# EAGLE design AlmosFinalMC (EAGLE 7.5.0)
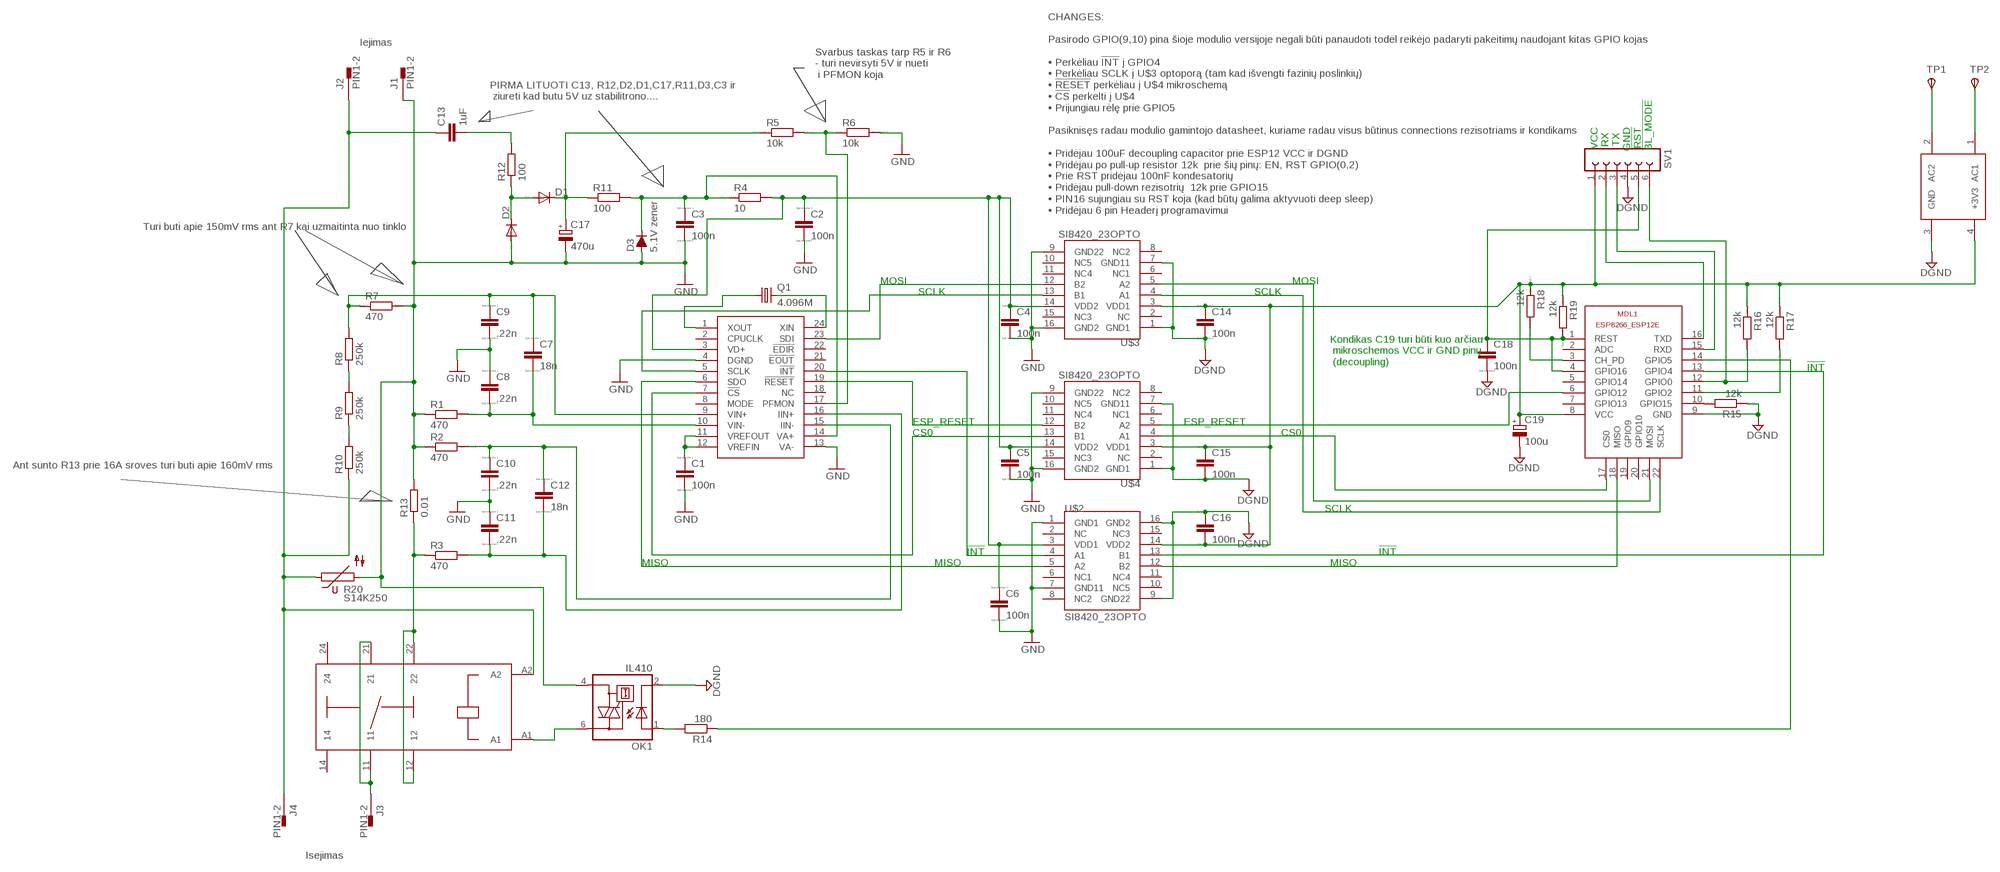
[diagram p0: schematic, sheet 1]

## Parts
C1  100n  C  [C0805]
C2  100n  C  [C0805]
C3  100n  C  [C0805]
C4  100n  C  [C0805]
C5  100n  C  [C0805]
C6  100n  C  [C0805]
C7  18n  C  [C0805]
C8  .22n  C  [C0805]
C9  .22n  C  [C0805]
C10  .22n  C  [C0805]
C11  .22n  C  [C0805]
C12  18n  C  [C0805]
C13  1uF  C-EU225-113X268  [C225-113X268]
C14  100n  C  [C0805]
C15  100n  C  [C0805]
C16  100n  C  [C0805]
C17  470u  CPOL-EUG  [PANASONIC_G]
C18  100n  C  [C0805]
C19  100u  CPOL-EUG  [PANASONIC_G]
D1  DIODE-DO-214AC  [DO-214AC]
D2  DIODE-DO-214AC  [DO-214AC]
D3  5.1V zener  D-FILL-SOD123  [SOD123]
J1  PIN1-2  [62221]
J2  PIN1-2  [62221]
J3  PIN1-2  [62221]
J4  PIN1-2  [62221]
MDL1  ESP8266-12EESP8266-ESP12E  [ESP8266-ESP12E]
OK1  IL410  [DIL06]
Q1  4.096M  CRYSTALHC49UP  [HC49UP]
R1  470  R  [R0805]
R2  470  R  [R0805]
R3  470  R  [R0805]
R4  10  R  [R0805]
R5  10k  R  [R0805]
R6  10k  R  [R0805]
R7  470  R  [R0805]
R8  250k  R-EU_0204/5  [0204/5]
R9  250k  R-EU_0204/5  [0204/5]
R10  250k  R-EU_0204/5  [0204/5]
R11  100  R-EU_0207/5V  [0207/5V]
R12  100  R-EU_0309/10  [0309/10]
R13  0.01  R-EU_RDH/15  [RDH/15]
R14  180  R-EU_R0805  [R0805]
R15  12k  R  [R0805]
R16  12k  R  [R0805]
R17  12k  R  [R0805]
R18  12k  R  [R0805]
R19  12k  R  [R0805]
R20  S14K250  [S14K250]
SV1  FE06-1  [FE06]
TP1  TPSPAD1-20Y  [P1-20Y]
TP2  TPSPAD1-20Y  [P1-20Y]
U$1  CS5460A  [SSOP24]
U$2  SI8420_23OPTO  [SI8420-SOIC8WB]
U$3  SI8420_23OPTO  [SI8420-SOIC8WB]
U$4  SI8420_23OPTO  [SI8420-SOIC8WB]
U$5  RAC02  [RAC02]
U$6  FINDER40-61  [FINDER40-61]

## Nets
DGND: C14.2 C15.2 C16.1 C18.2 C19.- MDL1.9(GND) OK1.2(C) R15.1 SV1.4 U$2.9(GND22) U$2.16(GND2) U$3.1(GND1) U$3.7(GND11) U$4.1(GND1) U$4.7(GND11) U$5.3(GND)
GND: C1.2 C2.2 C3.2 C4.2 C5.2 C6.2 C8.1 C9.2 C10.2 C11.1 C17.- D2.A D3.2(A) J1.1 OK1.4(A1) R1.1 R2.1 R6.2 R7.2 R13.2 R20.2 U$1.4(DGND) U$1.13(VA-) U$2.1(GND1) U$2.7(GND11) U$3.9(GND22) U$3.16(GND2) U$4.9(GND22) U$4.16(GND2)
N$1: C3.1 D3.1(C) R4.1 R11.2 U$1.14(VA+)
N$2: C2.1 C4.1 C5.1 C6.1 R4.2 U$1.3(VD+) U$2.3(VDD1) U$3.14(VDD2) U$4.14(VDD2)
N$3: R5.2 R6.1 U$1.17(PFMON)
N$4: C7.1 C9.1 R7.1 R8.2 U$1.9(VIN+)
N$5: U$1.23(SDI) U$3.12(B2)
N$6: C7.2 C8.2 R1.2 U$1.10(VIN-)
N$7: C17.+ D1.C R5.1 R11.1
N$8: D1.A D2.C R12.1
N$9: MDL1.14(GPIO5) R14.1
N$10: C10.1 C12.1 R2.2 U$1.15(IIN-)
N$11: C11.2 C12.2 R3.2 U$1.16(IIN+)
N$12: MDL1.16(TXD) SV1.2
N$13: C1.1 U$1.11(VREFOUT) U$1.12(VREFIN)
N$14: U$1.20(!INT!) U$2.4(A1)
N$15: U$1.6(SDO) U$2.5(A2)
N$16: R3.1 R13.1 U$6.12 U$6.22
N$17: C13.1 J2.1 J4.1 R10.1 R20.1 U$6.A2
N$18: R8.1 R9.2
N$19: R9.1 R10.2
N$20: C13.2 R12.2
N$21: MDL1.6(GPIO12) U$4.5(A2)
N$22: MDL1.15(RXD) SV1.3
N$23: U$1.7(!CS!) U$4.13(B1)
N$24: U$1.5(SCLK) U$3.13(B1)
N$25: U$1.19(!RESET!) U$4.12(B2)
N$26: MDL1.10(GPIO15) R15.2
N$27: MDL1.11(GPIO2) R17.2
N$28: TP1.TP(PP) U$5.2(AC2)
N$29: C14.1 C15.1 C16.2 C19.+ MDL1.8(VCC) R16.1 R17.1 R18.1 R19.1 SV1.1 U$2.14(VDD2) U$3.3(VDD1) U$4.3(VDD1) U$5.4(+3V3)
N$30: TP2.TP(PP) U$5.1(AC1)
N$31: Q1.1 U$1.1(XOUT)
N$32: Q1.2 U$1.24(XIN)
N$33: MDL1.22(SCLK) U$3.4(A1)
N$34: MDL1.17(CS0) U$4.4(A1)
N$35: OK1.1(A) R14.2
N$36: MDL1.21(MOSI) U$3.5(A2)
N$37: MDL1.3(CH_PD) R18.2
N$38: MDL1.18(MISO) U$2.12(B2)
N$39: MDL1.13(GPIO4) U$2.13(B1)
N$40: J3.1 U$6.11 U$6.21
N$42: OK1.6(A2) U$6.A1
N$43: MDL1.12(GPIO0) R16.2 SV1.6
N$45: C18.1 MDL1.1(REST) MDL1.4(GPIO16) R19.2 SV1.5
Unconnected: MDL1.2(ADC) MDL1.5(GPIO14) MDL1.7(GPIO13) MDL1.19(GPIO9) MDL1.20(GPIO10) U$1.2(CPUCLK) U$1.8(MODE) U$1.18(NC) U$1.21(!EOUT!) U$1.22(!EDIR!) U$2.2(NC) U$2.6(NC1) U$2.8(NC2) U$2.10(NC5) U$2.11(NC4) U$2.15(NC3) U$3.2(NC) U$3.6(NC1) U$3.8(NC2) U$3.10(NC5) U$3.11(NC4) U$3.15(NC3) U$4.2(NC) U$4.6(NC1) U$4.8(NC2) U$4.10(NC5) U$4.11(NC4) U$4.15(NC3) U$6.14 U$6.24

## Notes on the sheet
- Iejimas
- Svarbus taskas tarp R5 ir R6 
  - turi nevirsyti 5V ir nueti
   i PFMON koja
- PIRMA LITUOTI C13, R12,D2,D1,C17,R11,D3,C3 ir
   ziureti kad butu 5V uz stabilitrono....
- !BL_MODE!
- VCC | GND | !RST!
- RX | TX
- CHANGES:
  
  Pasirodo GPIO(9,10) pina šioje modulio versijoje negali būti panaudoti todėl reikėjo padaryti pakeitimų naudojant kitas GPIO kojas
  
  • Perkėliau !INT! į GPIO4
  • Perkėliau SCLK į U$3 optoporą (tam kad išvengti fazinių poslinkių)
  • !RESET! perkėliau į U$4 mikroschemą
  • !CS! perkelti į U$4
  • Prijungiau rėlę prie GPIO5
  
  Pasiknisęs radau modulio gamintojo datasheet, kuriame radau visus būtinus connections rezisotriams ir kondikams
  
  • Pridėjau 100uF decoupling capacitor prie ESP12 VCC ir DGND
  • Pridėjau po pull-up resistor 12k  prie šių pinų: EN, RST GPIO(0,2) 
  • Prie RST pridėjau 100nF kondesatorių 
  • Pridėjau pull-down rezisotrių  12k prie GPIO15
  • PIN16 sujungiau su RST koja (kad būtų galima aktyvuoti deep sleep)
  • Pridėjau 6 pin Headerį programavimui
- Turi buti apie 150mV rms ant R7 kai uzmaitinta nuo tinklo
- MOSI | MOSI
- SCLK | SCLK
- Kondikas C19 turi būti kuo arčiau
   mikroschemos VCC ir GND pinų
   (decoupling)
- !INT!
- ESP_RESET | ESP_RESET
- CS0 | CS0
- Ant sunto R13 prie 16A sroves turi buti apie 160mV rms
- SCLK
- !INT! | !INT!
- MISO | MISO | MISO
- Isejimas

## Library data of the parts
C1-C12 C14-C16 C18 = eagle-ltspice:C: CAPACITOR, European symbol; SPICEMODEL: NONE; SPICEPREFIX: C
C13 = rcl:C-EU: CAPACITOR, European symbol
C17 C19 = rcl:CPOL-EU: POLARIZED CAPACITOR, European symbol
D1 D2 = diode:DIODE-: DIODE
D3 = semicon-smd-ipc:D-FILL-: DIODE filled
J1-J4 = con-faston:PIN1-2: CONN TAB FASTON BRASS .187 PCB TAB, FSSTON, DUAL STAKE, .187 SERIES Digi-Key Part Number: A24734CT-ND Source: Tyco Electronics Corporation .. ENG_CD_62221_R.pdf http://search.digikey.com/scripts/DkSearch/dksus.dll?Detail&name=A24734CT-ND; MF: TYCO ELECTRONICS; MPN: 62221-1; OC_FARNELL: unknown; OC_NEWARK: 16H2318
MDL1 = ESP8266-ESP12E:ESP8266-12E: ESP8266-12E with additional I/O and GPIO04/05 corrected The author cannot warrant that this library is free from error or will meet your specific requirements. Created by PuceBaboon.com. Komagane, Nagano, JAPAN
OK1 = optocoupler:IL410: SIEMENS OPTO COUPLER; MF: VISHAY/TELEFUNKEN; MPN: IL410; OC_FARNELL: 1045434; OC_NEWARK: 58K1715
Q1 = crystal:CRYSTAL: CRYSTAL; OC_FARNELL: unknown; OC_NEWARK: unknown
R1-R7 R15-R19 = eagle-ltspice:R: RESISTOR, European symbol; SPICEMODEL: NONE; SPICEPREFIX: R
R8-R14 = resistor:R-EU_: RESISTOR, European symbol
R20 = varistor:S14K250: VARISTOR
SV1 = con-lsta:FE06-1: FEMALE HEADER; OC_FARNELL: unknown; OC_NEWARK: unknown
TP1 TP2 = testpad:TPS: TEST PIN
U$1 = CS5460Apwr:CS5460A
U$2-U$4 = Si8420WB:SI8420_23OPTO
U$5 = RAC02:RAC02
U$6 = Finder40_61:FINDER40-61

## Net classes
0 default: width 0.254 mm, drill 0.762 mm, clearance 0.152 mm

## Board
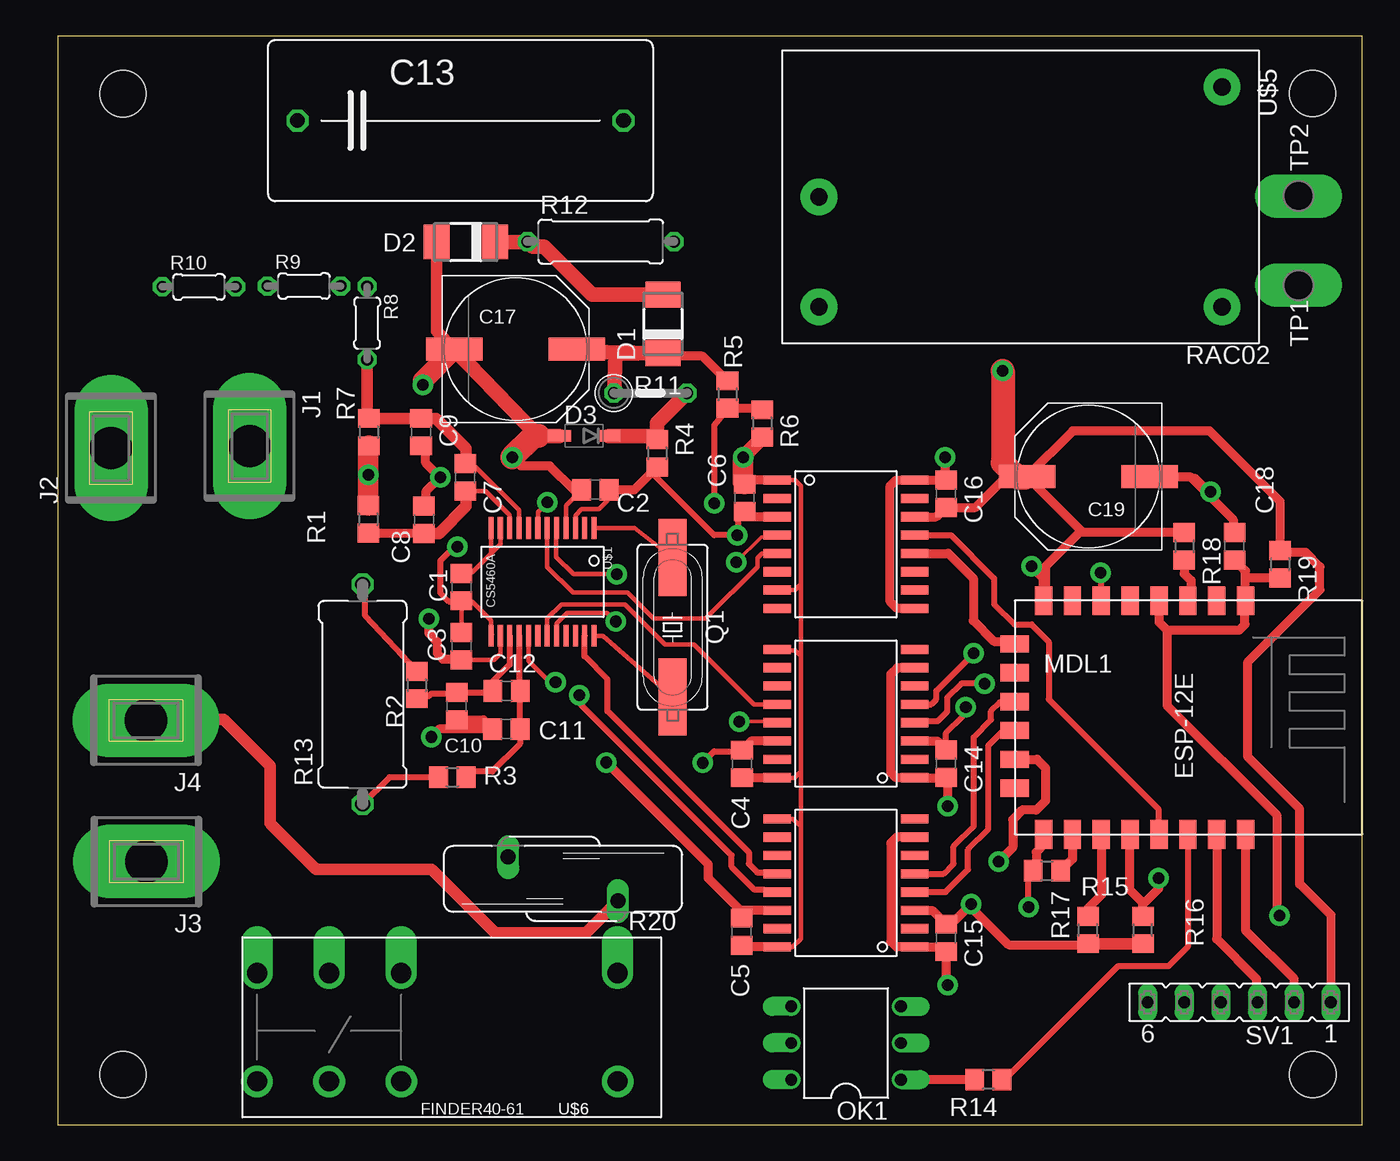
[diagram p1: board, top side]
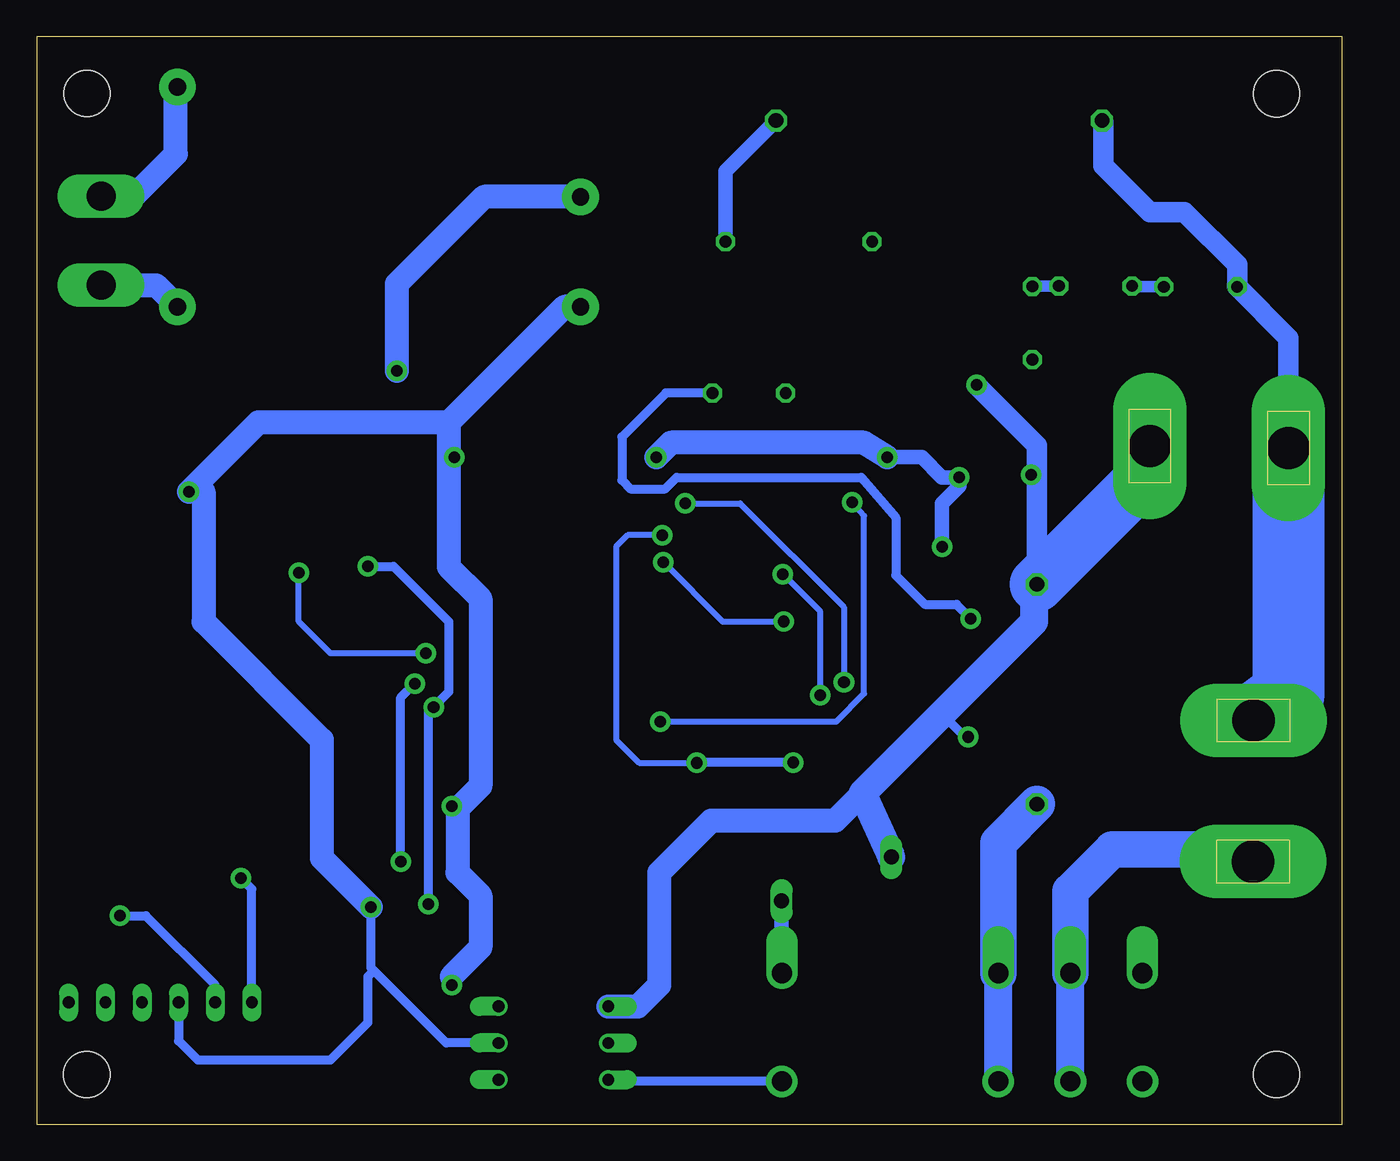
[diagram p2: board, bottom side, seen from below]

Size 90.44 x 75.5 mm. Coordinates in mm from the lower left corner, seen from the top.
Outline: 0,0 90.44,0 90.44,75.5 0,75.5 0,0
Copper layers (1*16): Top 0.035mm / dielectric 1.5mm / Bottom 0.035mm
Design rules "default": minimum track width 10mil, minimum drill 24mil, track to track 8mil, track to pad 8mil, pad to pad 8mil, via to via 8mil, smd to smd 8mil, copper to edge 40mil, drill to drill 8mil, minimum pad ring 10mil, minimum via ring 8mil, stop-mask expansion 4mil, vias tented up to drill 0mil, thermal gap 10mil
Holes 3.2 mm at 87,71.53 4.5,3.5 4.5,71.5 87,3.5

### Footprints (pad centres in the part's own frame; a part is rotated, then mirrored left to right if it is on the bottom)
C0805 = smd 1.3 x 1.5: 1 -0.95,0; 2 0.95,0
C225-113X268 = drill 1.016 octagon: 1 -11.303,0; 2 11.303,0
PANASONIC_G = smd 3.9 x 1.6: + 4.25,0; - -4.25,0
DO-214AC = smd 1.8 x 2.4: A 2.025,0; C -2.025,0
SOD123 = smd 1.6 x 0.8: 1 -1.7,0; 2 1.7,0
62221 = drill 2.921 pad 5.08 long: 1 0,0
ESP8266-ESP12E = smd 2 x 1.2: 1 0,16; 2 0,14; 3 0,12; 4 0,10; 5 0,8; 6 0,6; 7 0,4; 8 0,2; 9 16.2,2; 10 16.2,4; 11 16.2,6; 12 16.2,8; 13 16.2,10; 14 16.2,12; 15 16.2,14; 16 16.2,16 | smd 1.2 x 2: 17 11,0; 18 3,0; 19 5,0; 20 13,0; 21 7,0; 22 9,0
DIL06 = drill 0.813 offset: 1 -2.54,-3.81; 2 0,-3.81; 3 2.54,-3.81; 4 2.54,3.81; 5 0,3.81; 6 -2.54,3.81
HC49UP = smd 5.334 x 1.93: 1 -4.826,0; 2 4.826,0
R0805 = smd 1.3 x 1.5: 1 -0.95,0; 2 0.95,0
0204/5 = drill 0.813 octagon: 1 -2.54,0; 2 2.54,0
0207/5V = drill 0.813 octagon: 1 -2.54,0; 2 2.54,0
0309/10 = drill 0.813 octagon: 1 -5.08,0; 2 5.08,0
RDH/15 = drill 1.016 octagon: 1 -7.62,0; 2 7.62,0
S14K250 = drill 1.016 long: 1 -1.524,-3.81; 2 1.524,3.81
FE06 = drill 0.813 long: 1 -6.35,0; 2 -3.81,0; 3 -1.27,0; 4 1.27,0; 5 3.81,0; 6 6.35,0
P1-20Y = drill 2.007 pad 2.54 long: TP 0,0
SSOP24 = smd 1.5 x 0.35: 1 -3.9,3.25; 2 -3.9,2.6; 3 -3.9,1.95; 4 -3.9,1.3; 5 -3.9,0.65; 6 -3.9,0; 7 -3.9,-0.65; 8 -3.9,-1.3; 9 -3.9,-1.95; 10 -3.9,-2.6; 11 -3.9,-3.25; 12 -3.9,-3.9; 13 3.575,-3.9; 14 3.575,-3.25; 15 3.575,-2.6; 16 3.575,-1.95; 17 3.575,-1.3; 18 3.575,-0.65; 19 3.575,0; 20 3.575,0.65; 21 3.575,1.3; 22 3.575,1.95; 23 3.575,2.6; 24 3.575,3.25
SI8420-SOIC8WB = smd 1.9 x 0.635: 1 -4.445,4.445; 2 -4.445,3.175; 3 -4.445,1.905; 4 -4.445,0.635; 5 -4.445,-0.635; 6 -4.445,-1.905; 7 -4.445,-3.175; 8 -4.445,-4.445; 9 5.08,-4.445; 10 5.08,-3.175; 11 5.08,-1.905; 12 5.08,-0.635; 13 5.08,0.635; 14 5.08,1.905; 15 5.08,3.175; 16 5.08,4.445
RAC02 = drill 1.2 pad 2.54: 1 -12.7,-7.62; 2 -12.7,7.62; 3 15.24,7.62; 4 15.24,0
FINDER40-61 = drill 1.4 pad 2.184: 11 5,5; 12 0,5; 14 10,5; A1 -15,5 | drill 1.4 pad 2.184 offset: 21 5,-2.5; 22 0,-2.5; 24 10,-2.5; A2 -15,-2.5

### Placement (x,y rotation side)
C1  27.97,37.29 270 top
C2  37.26,44.04 180 top
C3  27.98,33.2 90 top
C4  47.43,25.02 270 top
C5  47.41,13.39 270 top
C6  47.6,43.48 90 top
C7  28.24,44.9 270 top
C8  25.38,41.96 270 top
C9  25.18,48.04 270 top
C10  27.65,29.03 270 top
C11  31.08,27.45 0 top
C12  31.1,30.09 0 top
C13  27.91,69.64 0 top
C14  61.58,25.05 270 top
C15  61.58,12.97 270 top
C16  61.58,43.76 270 top
C17  31.73,53.8 0 top
C18  81.58,40.12 90 top
C19  71.44,44.95 180 top
D1  41.95,55.54 90 top
D2  28.27,61.22 180 top
D3  36.47,47.78 180 top
J1  13.28,47.07 270 top
J2  3.68,46.93 90 top
J3  6.13,18.25 180 top
J4  6.1,28.05 180 top
MDL1  66.33,36.34 270 top
OK1  54.64,5.68 90 top
Q1  42.61,34.52 270 top
R1  21.51,41.99 270 top
R2  24.88,30.49 270 top
R3  27.34,24.11 0 top
R4  41.55,46.57 270 top
R5  46.42,50.65 270 top
R6  48.82,48.64 270 top
R7  21.55,48.04 270 top
R8  21.43,55.6 270 top
R9  17.06,58.17 0 top
R10  9.78,58.11 0 top
R11  41.08,50.75 0 top
R12  37.63,61.25 0 top
R13  21.12,29.86 90 top
R14  64.5,3.13 180 top
R15  68.56,17.62 0 top
R16  75.22,13.52 90 top
R17  71.42,13.52 90 top
R18  78.09,40.12 270 top
R19  84.73,38.87 270 top
R20  35.02,17.05 90 top
SV1  81.9,8.49 180 top
TP1  86,58.23 90 top
TP2  86,64.4 90 top
U$1  33.92,37.49 270 top
U$2  54.31,40.26 0 top
U$3  54.95,16.78 180 top
U$4  54.95,28.52 180 top
U$5  68,64.35 180 top
U$6  23.8,8.02 180 top

### Tracks (layer width: path | path; a pad name or v marks a point on that pad's centre or on a via)
DGND  (via drill 0.8 pad 1.42)
  Top 0.406: C19.- 78.84,44.95 v79.9,43.9 | v67.3,15.1 67.3,17.3 R15.1
  Top 0.61: U$4.7 58.19,31.7 57.75,31.25 57.75,24.43 58.1,24.07 U$4.1 61.56,24.07 C14.2 61.7,23.98 v61.7,22.1 | U$3.7 58.16,19.95 57.75,19.55 57.75,12.73 58.14,12.34 U$3.1 61.27,12.34 C15.2 61.58,9.82 v61.7,9.7 | MDL1.9 68.33,19.41 67.83,18.9 67.83,17.83 R15.1 | C19.- 78.5,44.95 81.47,41.98 81.47,41.17 C18.2 | v61.5,46.3 61.5,44.79 C16.1 U$2.16 58.1,44.7 57.7,44.3 57.7,36.3 58.19,35.81 U$2.9
  Bottom 0.406: v79.9,43.9 78.9,43.9
  Bottom 0.61: OK1.2 62.08,5.68 67.1,10.7 | 67.1,10.7 67.3,10.9 v67.3,15.1 | SV1.4 80.63,5.83 79.3,4.5 70.1,4.5 67.5,7.1 67.5,10.3 67.1,10.7 | v61.7,9.7 61.7,10.3 | 61.3,21.9 61.5,21.9 v61.7,22.1 | 61.9,48.7 61.9,46.7 v61.5,46.3
  Bottom 1.676: U$5.3 53.87,56.73 61.9,48.7 | 61.9,48.7 75.1,48.7 v79.9,43.9 | 78.9,43.9 78.9,34.9 70.7,26.7 70.7,18.5 v67.3,15.1 | 61.9,48.7 61.9,38.7 59.7,36.5 59.7,23.5 61.3,21.9 61.3,17.5 59.7,15.9 59.7,12.3 61.7,10.3
GND  (via drill 0.8 pad 1.42)
  Top 0.305: 30.1,33.99 U$1.13 30.02,34.98 28.7,36.3 27.93,36.3 | U$3.9 50.98,21.23 51.5,20.7 | 51.5,20.7 51.5,12.9 50.9,12.3 49.91,12.3 U$3.16 | U$4.16 51.08,24.07 51.5,24.5 | 51.5,24.5 51.5,32.5 | 51.5,32.5 51.1,32.9 49.94,32.9 U$4.9 | U$2.7 51.09,37.09 51.5,37.5 | 51.5,37.5 51.5,44.3 51.1,44.7 U$2.1 | 27.58,36.34 C1.2 C3.2 | 51.5,37.5 51.5,32.5 | 51.5,24.5 51.5,20.7 | U$1.4 35.22,42.95 C2.2
  Top 0.406: v27.7,40.1 27.5,40.1 26.5,39.1 26.5,36.9 27.1,36.3 27.93,36.3 C1.2 | R2.1 23.88,32.52 21.3,35.3 21.3,37.3 R13.2
  Top 0.61: U$3.16 47.52,12.34 C5.2 | U$4.16 C4.2 | U$2.1 47.88,44.7 C6.2 | C10.2 29.49,28.09 C11.1 26.45,27.45 v25.9,26.9 | C8.1 25.5,43.03 25.5,43.9 v26.5,44.9 25.5,45.9 25.5,46.77 C9.2 | C2.2 35.76,44.04 34.1,45.7 32.1,45.7 v31.5,46.3
  Top 0.813: 25.35,42.94 C8.1 | D2.A 26.24,55.03 C17.-
  Top 1.016: D3.2 33.3,47.78 C17.- | R6.2 48.82,47.62 v47.5,46.3 | 25.3,46.97 C9.2 | 25.3,42.99 C8.1
  Top 1.422: v47.5,46.3 47.5,44.53 C6.2 | v25.3,51.3 25.3,51.62 C17.- | R1.1 v21.51,45.07 21.51,47.05 R7.2
  Top 1.676: 33.3,47.78 32.9,47.7 v31.5,46.3
  Bottom 0.61: v25.9,26.9 26.1,26.9 27.7,28.5
  Bottom 1.016: v31.5,46.3 29.1,46.3 27.7,44.9 v26.5,44.9 26.5,44.3 27.7,43.1 v27.7,40.1
  Bottom 1.422: R13.2 21.12,45.1 | 21.12,45.1 21.12,47.12 v25.3,51.3 | v21.51,45.07 21.15,45.07 21.12,45.1
  Bottom 1.676: OK1.4 48.78,8.21 47.3,9.7 47.3,17.5 43.7,21.1 35.1,21.1 33,23.2 | v31.5,46.3 33.1,47.3 46.5,47.3 v47.5,46.3
  Bottom 1.93: R20.2 33.21,22.99 33,23.2 27.7,28.5 21.3,34.9 21.3,37.3 R13.2
  Bottom 3.81: J1.1 13.28,45.32 R13.2
N$1  (via drill 0.8 pad 1.42)
  Top 0.305: C3.1 30.24,32.24 30.7,32.7 30.7,33.88 U$1.14
  Top 0.61: v25.7,35.1 25.7,34.1 26.3,33.5 26.3,32.7 26.7,32.3 27.92,32.3 C3.1
  Top 1.016: D3.1 41.29,47.78 R4.1 41.55,48.68 R11.2
  Bottom 0.61: R11.2 46.85,50.75 49.9,47.7 49.9,44.7 49.3,44.1 46.9,44.1 46.1,44.9 33.3,44.9 30.9,42.1 30.9,38.1 28.9,36.1 26.7,36.1 v25.7,35.1
N$2  (via drill 0.8 pad 1.42)
  Top 0.305: U$1.3 35.87,42.27 36.3,42.7 37.5,42.7 38.1,43.3 38.1,43.93 C2.1
  Top 0.406: U$2.3 47.16,42.16 v47.1,40.9 45.5,40.9 41.16,45.23 | v44.7,25.1 45.5,25.9 47.35,25.9 C4.1
  Top 0.61: U$3.14 47.94,14.88 | 47.94,14.88 C5.1 | U$4.14 48.07,26.61 C4.1 | U$2.3 47.97,42.16 C6.1 | 47.94,14.88 47.33,14.88 45.1,17.1 45.1,18.05 v38.02,25.13 | C2.1 39.97,44.04 41.16,45.23 R4.2
  Bottom 0.254: 44.59,24.99 v44.7,25.1
  Bottom 0.406: v47.1,40.9 49.5,40.9 50.3,40.1 50.3,26.7 48.7,25.1 v44.7,25.1
  Bottom 0.61: v38.02,25.13 44.67,25.13 v44.7,25.1
N$3  (via drill 0.8 pad 1.42)
  Top 0.305: v34.5,30.7 34.1,30.7 32.62,32.18 U$1.17
  Top 0.406: R5.2 46.42,49.62 45.5,48.5 v45.5,43.1
  Top 0.61: R5.2 48.71,49.7 R6.1
  Bottom 0.406: v45.5,43.1 41.7,43.1 34.5,35.9 v34.5,30.7
N$4
  Top 0.305: U$1.9 31.97,42.63 28.9,45.7 28.39,45.7 C7.1
  Top 0.813: R8.2 21.43,49.12 R7.1 C9.1 26.21,48.99 28.3,46.9 28.3,45.91 C7.1
N$5
  Top 0.406: U$1.23 36.5,33.9 36.5,32.5 38.1,30.9 38.1,28.7 47.9,18.9 47.9,18.1 48.5,17.5 49.78,17.5 U$3.12
N$6
  Top 0.305: C7.2 29.65,43.95 31.3,42.3 31.3,41.41 U$1.10
  Top 0.61: R1.2 25.35,41.04 C8.2
  Top 0.813: C8.2 26.41,41.01 28.3,42.9 28.3,43.89 C7.2
N$7
  Top 0.61: R5.1 46.4,51.6 44.7,53.3 42.16,53.3 D1.C
  Top 1.016: C17.+ 38.03,53.6 D1.C 38.65,53.44 R11.1
N$8
  Top 1.016: D2.C 32.52,61.22 R12.1 32.9,60.9 33.7,60.9 37.03,57.56 D1.A
N$9
  Top 0.406: MDL1.14 78.33,12.34 77,11 73.5,11 66,3.5 65.82,3.5 R14.1
  Top 0.61: 65.62,3.3 R14.1
N$10
  Top 0.406: U$1.15 31.32,31.92 30.1,30.7 30.1,30.15 C12.1 30.05,29.98 C10.1 | 27.48,30.15 C10.1 | R2.2 25.74,29.74 25.9,29.9 27.56,29.9 C10.1
N$11
  Top 0.406: U$1.16 31.97,30.17 C12.2 32.03,30.06 C11.2 32.03,26.43 30.1,24.5 28.68,24.5 R3.2
N$12
  Top 0.61: MDL1.16 82.33,13.49 85.71,10.12 SV1.2
N$13
  Top 0.305: U$1.11 30.67,40.27 30.02,39.62 | 30.02,39.62 28.7,38.3 27.63,38.3 C1.1 | U$1.12 30.02,39.62
N$14  (via drill 0.8 pad 1.4, 0.8 pad 1.42)
  Top 0.254: v47.02,39.02 48.77,40.76 49.85,40.76 U$2.4 | 34.53,34.13 U$1.20
  Top 0.305: v38.68,34.91 38.08,35.51 35.3,35.51 34.57,34.77 U$1.20
  Bottom 0.406: v38.68,34.91 42.91,34.91 v47.02,39.02
N$15
  Top 0.305: U$2.5 48.83,39.62 48.5,39.3 48.5,38.7 44.9,35.1 41.3,35.1 39.5,36.9 35.7,36.9 33.9,38.7 33.9,41.37 U$1.6
N$16
  Top 0.406: R3.1 22.99,24.11 R13.1
  Bottom 1.93: U$6.12 U$6.22
  Bottom 2.54: U$6.22 23.8,19.56 R13.1
N$17
  Top 0.813: R20.1 36.6,13.3 30.3,13.3 25.9,17.7 17.9,17.7 14.7,20.9 14.7,24.9 11.5,28.1 5.55,28.1 J4.1
  Bottom 1.016: R20.1 38.83,10.55 U$6.A2
  Bottom 1.422: J2.1 3.68,54.55 R10.1 7.24,59.64 10.9,63.3 13.3,63.3 16.5,66.5 16.5,69.54 C13.1
  Bottom 5: J2.1 3.68,29.88 J4.1
N$18
  Bottom 0.813: R9.2 21.4,58.17 R8.1
N$19
  Bottom 0.813: R10.2 14.46,58.11 R9.1
N$20
  Bottom 1.016: R12.2 42.71,66.14 C13.2
N$21  (via drill 0.8 pad 1.42)
  Top 0.406: U$4.5 60.56,29.16 60.9,29.5 60.9,30.1 v63.5,32.7 | v72.3,38.3 72.3,36.38 MDL1.6
  Bottom 0.406: v63.5,32.7 70.1,32.7 72.3,34.9 v72.3,38.3
N$22
  Top 0.61: MDL1.15 80.33,12.89 83.1,10.12 83.1,8.06 SV1.3
N$23  (via drill 0.8 pad 1.42)
  Top 0.254: v47.22,27.96 49.85,27.96 U$4.13
  Top 0.305: U$1.7 33.27,42.5 v33.93,43.16
  Bottom 0.305: 35.02,27.96 35.02,27.98
  Bottom 0.406: v47.22,27.96 35.02,27.96 | 35.02,27.98 33.1,29.9 33.1,42.23 v33.93,43.16
N$24  (via drill 0.8 pad 1.42)
  Top 0.254: 48.94,16.3 49.85,16.3 U$3.13 | 34.53,41.22 U$1.5
  Top 0.305: v38.73,38.19 35.73,38.19 34.53,39.39 34.53,41.22
  Top 0.406: 48.94,16.3 48.3,16.3 46.7,17.9 46.7,18.7 36.3,29.1 36.3,29.62 v36.13,29.79
  Bottom 0.406: v36.13,29.79 36.13,35.59 v38.73,38.19
N$25
  Top 0.305: U$4.12 48.24,29.16 44.1,33.3 42.1,33.3 39.3,36.1 34.9,36.1 33.92,35.12 U$1.19
N$26
  Top 0.61: MDL1.10 70.33,18.44 R15.2
N$27
  Top 0.61: R17.2 71.42,15.02 72.38,15.98 72.38,20.11 MDL1.11
N$28
  Bottom 1.676: TP1.TP 82.2,58.23 U$5.2
N$29  (via drill 0.8 pad 1.42)
  Top 0.406: C14.1 61.58,27.18 62.7,28.3 62.7,28.73 v62.95,28.98
  Top 0.61: U$2.14 60.86,42.16 61.51,42.81 C16.2 63.61,42.81 66.1,45.3 | U$4.3 60.97,26.61 C14.1 | U$3.3 60.62,14.88 C15.1 61.92,13.92 v63.3,15.3 63.3,15.1 65.9,12.5 71.35,12.5 R17.1 | R18.1 71.08,41.08 | 71.08,41.08 C19.+ 70.36,48.12 79.85,48.12 84.73,43.24 R19.1 84.86,39.7 86.5,39.7 87.5,38.7 87.5,37.1 82.5,32.1 82.5,25.5 86.1,21.9 86.1,16.7 88.25,14.55 SV1.1 | 71.08,41.08 70.83,41.08 68.47,38.73 68.47,36.48 MDL1.8 68.33,37.89 v67.5,38.73
  Top 0.813: R17.1 R16.1
  Top 1.676: v65.5,52.3 65.5,45.9 66.1,45.3 66.5,44.9 67.14,44.9 C19.+
  Bottom 0.61: v67.5,38.73 65.72,38.73 61.9,34.9 61.9,30.02 v62.95,28.98 63.3,28.62 v63.3,15.3
  Bottom 1.676: U$5.4 59.45,64.35 65.5,58.3 v65.5,52.3
N$30
  Bottom 1.676: TP2.TP 83.75,64.4 80.83,67.33 80.83,71.35 U$5.1
N$31
  Top 0.305: U$1.1 39.96,41.39 Q1.1
N$32
  Top 0.305: U$1.24 37.78,33.91 Q1.2
N$33
  Top 0.406: U$3.4 61.55,16.14 63.1,17.7 63.1,19.1 64.5,20.5 64.5,26.3 65.5,27.3 66.29,27.3 MDL1.22
N$34  (via drill 0.8 pad 1.42)
  Top 0.406: v64.25,30.6 62.62,30.6 61.65,29.62 61.65,28.65 61,28 59.51,28 U$4.4
  Top 0.61: MDL1.17 67.88,25.34 68.47,24.75 68.47,22.48 67.83,21.82 66.85,21.82 66.2,21.18 66.2,19.23 v65.22,18.25
  Bottom 0.61: v65.22,18.25 65.22,29.62 v64.25,30.6
N$35
  Top 0.61: R14.2 OK1.1
N$36
  Top 0.406: U$3.5 61.42,17.41 62.1,18.1 62.1,19.3 63.5,20.7 63.5,26.9 64.7,28.1 64.7,28.7 65.3,29.3 66.29,29.3 MDL1.21
N$37
  Top 0.61: R18.2 78.09,38.21 78.55,37.75 78.55,36.56 MDL1.3
N$38
  Top 0.61: U$2.12 61.72,39.62 63.45,37.9 63.45,34.97 64.9,33.52 66.16,33.52 MDL1.18
N$39
  Top 0.406: U$2.13 61.91,40.9 64.9,37.9 64.9,36.1 66.3,34.7 67.5,34.7 68.7,33.5 68.7,29.5 76.3,21.9 76.3,20.18 MDL1.13
N$40
  Bottom 1.93: U$6.11 U$6.21
  Bottom 2.54: U$6.21 18.8,16.2 15.9,19.1 6.38,19.1 J3.1
N$42
  Bottom 0.61: U$6.A1 50.72,3.02 OK1.6
N$43  (via drill 0.8 pad 1.42)
  Top 0.61: R16.2 75.22,15.3 | 75.22,15.3 75.22,15.4 74.33,16.3 MDL1.12 | v76.3,17.1 76.3,16.38 75.22,15.3
  Bottom 0.61: SV1.6 75.55,16.35 v76.3,17.1
N$45  (via drill 0.8 pad 1.42)
  Top 0.61: 82.33,37.75 MDL1.1 82.3,36.31 82.3,34.7 81.9,34.3 76.9,34.3 | 82.33,37.75 82.33,38.41 C18.1 | R19.2 82.5,37.92 82.33,37.75 | MDL1.4 76.33,34.87 76.9,34.3 | 76.9,34.3 76.9,29.1 84.5,21.5 84.5,14.7 v84.7,14.5
  Bottom 0.61: v84.7,14.5 82.9,14.5 78.1,9.7 78.1,8.01 SV1.5